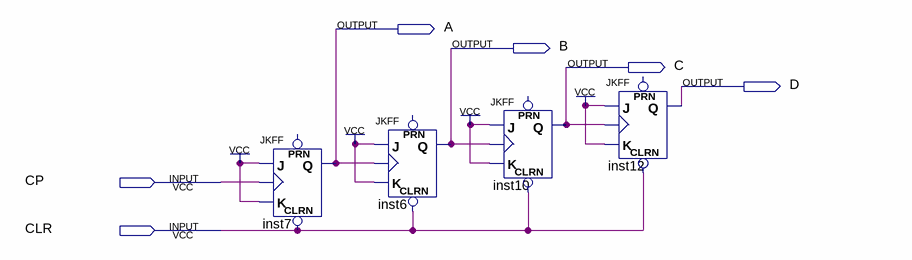
[diagram p0: schematic sheet]
// Quartus schematic Problem1.bdf as structural Verilog: 4 symbols, 6 pins
module Problem1 (
  input  CP,
  input  CLR,
  output A,
  output B,
  output C,
  output D
);

  JKFF inst7 (.CLRN(CLR), .K(1'b1), .J(1'b1), .CLK(CP), .Q(A));  // open: PRN
  JKFF inst6 (.CLRN(CLR), .K(1'b1), .J(1'b1), .CLK(A), .Q(B));  // open: PRN
  JKFF inst10 (.CLRN(CLR), .K(1'b1), .J(1'b1), .CLK(B), .Q(C));  // open: PRN
  JKFF inst12 (.CLRN(CLR), .K(1'b1), .J(1'b1), .CLK(C), .Q(D));  // open: PRN
endmodule
